# Altium schematic sheet pca10143_sheet4_misc.SchDoc: PCA10143 - Miscellaneous
size A3; Organization: Nordic Semiconductor; DocumentNumber: 4; Revision: 0.7.2; SheetNumber: 4; SheetTotal: 7; CompanyName: Nordic Semiconductor
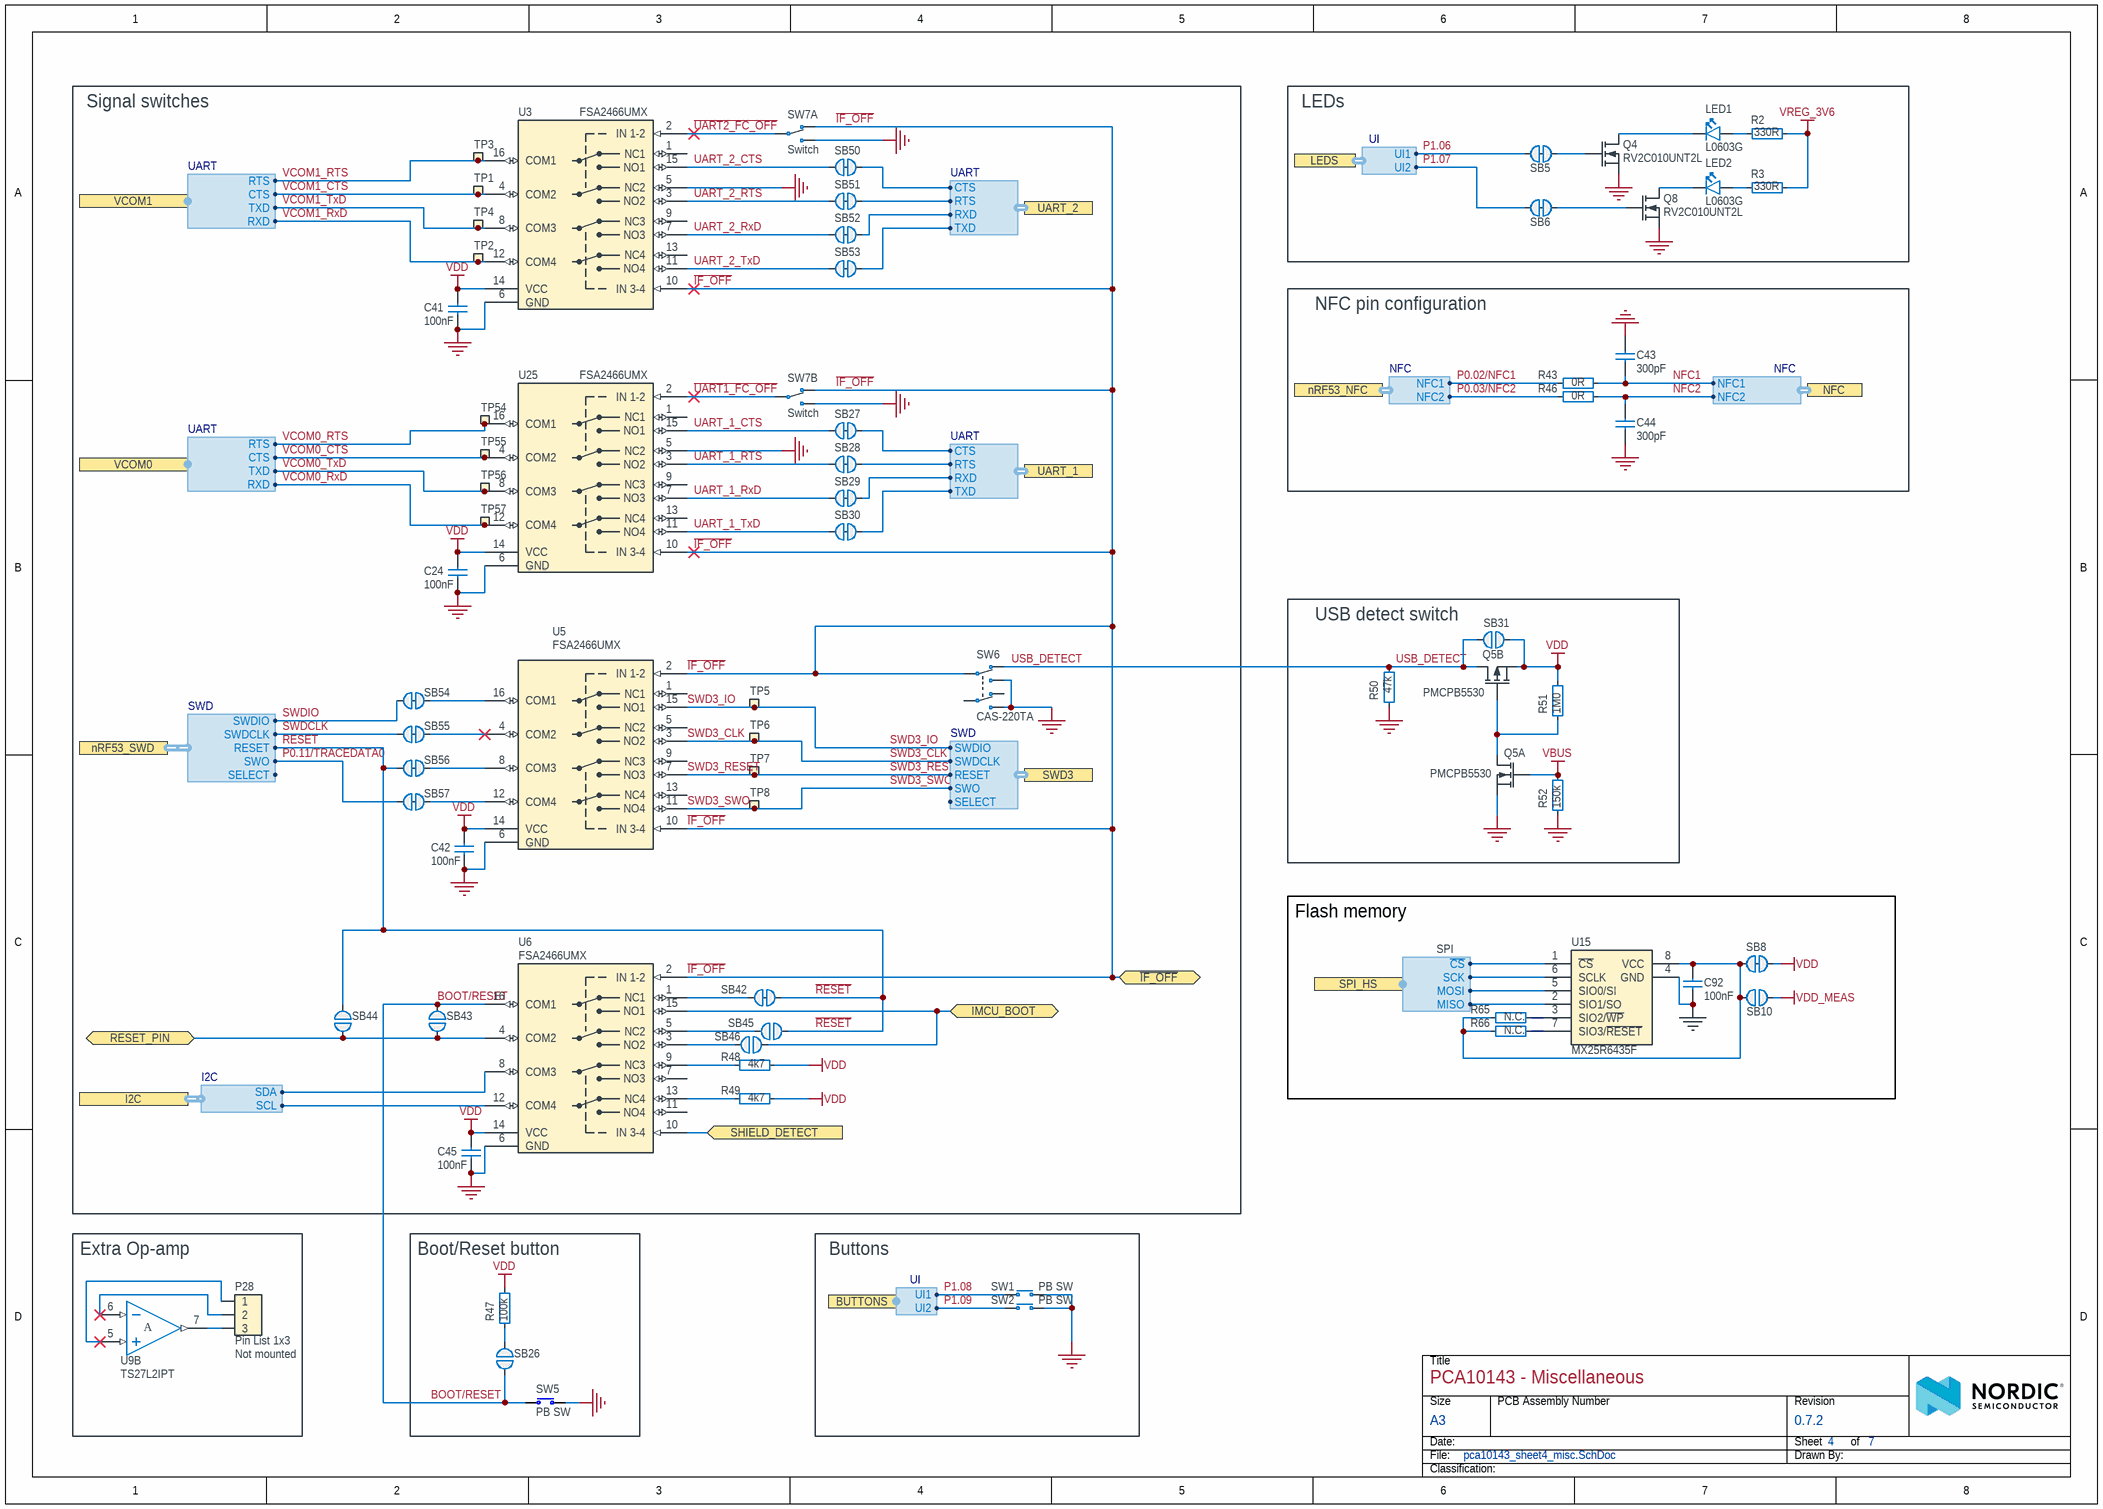
[diagram p0: pca10143_sheet4_misc.SchDoc]

## Parts
C24  100nF  [CAPC0603X03L_C]
C41  100nF  [CAPC0603X03L_C]
C42  100nF  [CAPC0603X03L_C]
C43  300pF  [CAPC1005X04L]
C44  300pF  [CAPC1005X04L]
C45  100nF  [CAPC0603X03L_C]
C92  100nF  [CAPC0603X03L_C]
LED1  L0603G  [LED_0603_G]
LED2  L0603G  [LED_0603_G]
P28  Pin List 1x3  Assembly: Not mounted  [LIST_1x3-NC]
Q4  RV2C010UNT2L  [DFN65P100X40-3L]
Q5  PMCPB5530  [PMCPB5530X]  (parts A,B of 2)
Q8  RV2C010UNT2L  [DFN65P100X40-3L]
R2  330R  [RESC0603X03L_C]
R3  330R  [RESC0603X03L_C]
R43  0R  [RESC0603X03L_C]
R46  0R  [RESC0603X03L_C]
R47  100k  [RESC0603X03L_C]
R48  4k7  [RESC0603X03L_C]
R49  4k7  [RESC0603X03L_C]
R50  47k  [RESC0603X03L_C]
R51  1M0  [RESC0603X03L_C]
R52  150k  [RESC0603X03L_C]
R65  N.C.  [RESC0603X03L_C_NC]
R66  N.C.  [RESC0603X03L_C_NC]
SB5  Solderbridge  [Solderbridge_Shorted]  (value not drawn)  (net tie, no BOM)
SB6  Solderbridge  [Solderbridge_Shorted]  (value not drawn)  (net tie, no BOM)
SB8  Solderbridge  [Solderbridge_Shorted]  (value not drawn)  (net tie, no BOM)
SB10  Solderbridge  [Solderbridge]  (value not drawn)  (no BOM)
SB26  Solderbridge  [Solderbridge]  (value not drawn)  (no BOM)
SB27  Solderbridge  [Solderbridge_Shorted]  (value not drawn)  (net tie, no BOM)
SB28  Solderbridge  [Solderbridge_Shorted]  (value not drawn)  (net tie, no BOM)
SB29  Solderbridge  [Solderbridge_Shorted]  (value not drawn)  (net tie, no BOM)
SB30  Solderbridge  [Solderbridge_Shorted]  (value not drawn)  (net tie, no BOM)
SB31  Solderbridge  [Solderbridge]  (value not drawn)  (no BOM)
SB42  Solderbridge  [Solderbridge_Shorted]  (value not drawn)  (net tie, no BOM)
SB43  Solderbridge  [Solderbridge]  (value not drawn)  (no BOM)
SB44  Solderbridge  [Solderbridge]  (value not drawn)  (no BOM)
SB45  Solderbridge  [Solderbridge]  (value not drawn)  (no BOM)
SB46  Solderbridge  [Solderbridge]  (value not drawn)  (no BOM)
SB50  Solderbridge  [Solderbridge_Shorted]  (value not drawn)  (net tie, no BOM)
SB51  Solderbridge  [Solderbridge_Shorted]  (value not drawn)  (net tie, no BOM)
SB52  Solderbridge  [Solderbridge_Shorted]  (value not drawn)  (net tie, no BOM)
SB53  Solderbridge  [Solderbridge_Shorted]  (value not drawn)  (net tie, no BOM)
SB54  Solderbridge  [Solderbridge_Shorted]  (value not drawn)  (net tie, no BOM)
SB55  Solderbridge  [Solderbridge_Shorted]  (value not drawn)  (net tie, no BOM)
SB56  Solderbridge  [Solderbridge_Shorted]  (value not drawn)  (net tie, no BOM)
SB57  Solderbridge  [Solderbridge_Shorted]  (value not drawn)  (net tie, no BOM)
SW1  PB SW  [Switch-PB-6.2x6.3mm-SMD]
SW2  PB SW  [Switch-PB-6.2x6.3mm-SMD]
SW5  PB SW  [Switch-PB-6.2x6.3mm-SMD]
SW6  CAS-220TA  [CAS-220TA]
SW7  Switch  [CAS-D20A]  (parts A,B of 2)
TP1  Ø1.5mm,SMD  [TP_SMD_D1.5mm]  (value not drawn)  (no BOM)
TP2  Ø1.5mm,SMD  [TP_SMD_D1.5mm]  (value not drawn)  (no BOM)
TP3  Ø1.5mm,SMD  [TP_SMD_D1.5mm]  (value not drawn)  (no BOM)
TP4  Ø1.5mm,SMD  [TP_SMD_D1.5mm]  (value not drawn)  (no BOM)
TP5  Ø1.5mm,SMD  [TP_SMD_D1.5mm]  (value not drawn)  (no BOM)
TP6  Ø1.5mm,SMD  [TP_SMD_D1.5mm]  (value not drawn)  (no BOM)
TP7  Ø1.5mm,SMD  [TP_SMD_D1.5mm]  (value not drawn)  (no BOM)
TP8  Ø1.5mm,SMD  [TP_SMD_D1.5mm]  (value not drawn)  (no BOM)
TP54  Ø1.5mm,SMD  [TP_SMD_D1.5mm]  (value not drawn)  (no BOM)
TP55  Ø1.5mm,SMD  [TP_SMD_D1.5mm]  (value not drawn)  (no BOM)
TP56  Ø1.5mm,SMD  [TP_SMD_D1.5mm]  (value not drawn)  (no BOM)
TP57  Ø1.5mm,SMD  [TP_SMD_D1.5mm]  (value not drawn)  (no BOM)
U3  FSA2466UMX  [XQFN40P180X260X50-16N]
U5  FSA2466UMX  [XQFN40P180X260X50-16N]
U6  FSA2466UMX  [XQFN40P180X260X50-16N]
U9  TS27L2IPT  [TSOP65P640X120-8N]  (part B of 2)
U15  MX25R6435F  [SON127P600X80_HS-9N]
U25  FSA2466UMX  [XQFN40P180X260X50-16N]

## Blocks framed on the sheet
Signal switches: C24 C41 C42 C45 R48 R49 SB27-SB30 SB42-SB46 SB50-SB57 SW6 SW7 TP1-TP8 TP54-TP57 U3 U5 U6 U25
LEDs: LED1 LED2 Q4 Q8 R2 R3 SB5 SB6
NFC pin configuration: C43 C44 R43 R46
USB detect switch: Q5 R50-R52 SB31
Flash memory: C92 R65 R66 SB8 SB10 U15
Extra Op-amp: P28 U9
Boot/Reset button: R47 SB26 SW5
Buttons: SW1 SW2

## Ports
BUTTONS (harness UI), I2C (harness I2C), IMCU_BOOT (bidir), LEDS (harness UI), NFC (harness NFC), nRF53_NFC (harness NFC), nRF53_SWD (harness SWD), RESET_PIN (bidir), SHIELD_DETECT (in), SPI_HS (harness SPI), SWD3 (harness SWD), UART_1 (harness UART), UART_2 (harness UART), VCOM0 (harness UART), VCOM1 (harness UART), ~{IF_OFF} (bidir)

## Harnesses
SWD: SWDIO, SWDCLK, SWO, RESET, SELECT
NFC: NFC2, NFC1
UI: UI2, UI1
UART: RTS, CTS, RXD, TXD
I2C: SCL, SDA
SPI: ~{CS}, SCK, MISO, MOSI

## Nets
GND: C24.1 C41.1 C42.1 C43.2 C44.1 C45.1 C92.1 Q4.2(S) Q5.1(S1) Q8.2(S) R50.2 R52.2 SW1.1(N.O) SW2.1(N.O) SW5.1(N.O) SW6.1(N.O-1) SW6.4(N.O-2) SW7.1(N.O) SW7.4(N.O) U3.5(NC2) U3.6(GND) U5.6(GND) U6.6(GND) U15.4(GND) U15.9(GND) U25.5(NC2) U25.6(GND)
VBUS: Q5.2(G1) R52.1
VDD: C24.2 C41.2 C42.2 C45.2 Q5.4(S2) R47.2 R48.1 R49.1 R51.1 SB8.1 SB31.1 U3.14(VCC) U5.14(VCC) U6.14(VCC) U25.14(VCC)
VDD_MEAS: SB10.1
VREG_3V6: R2.2 R3.2
BOOT/RESET: SB26.1 SB43.1 SW5.2(COM) U6.16(COM1)
~{IF_OFF}: SW6.2(COM-1) SW7.3(N.C) SW7.6(N.C) U3.10(IN_3-4) U5.2(IN_1-2) U5.10(IN_3-4) U6.2(IN_1-2) U25.10(IN_3-4) ; port ~{IF_OFF}
IMCU_BOOT: SB46.2 U6.15(NO1) ; port IMCU_BOOT
NFC1: C43.1 R43.1 ; port NFC.NFC1
NFC2: C44.2 R46.1 ; port NFC.NFC2
P0.02/NFC1: R43.2 ; port nRF53_NFC.NFC1
P0.03/NFC2: R46.2 ; port nRF53_NFC.NFC2
P0.11/TRACEDATA0: SB57.1 ; port nRF53_SWD.SWO
P1.06: SB5.1 ; port LEDS.UI1
P1.07: SB6.1 ; port LEDS.UI2
P1.08: SW1.2(COM) ; port BUTTONS.UI1
P1.09: SW2.2(COM) ; port BUTTONS.UI2
~{RESET}: SB42.2 SB44.2 SB45.2 SB56.1 ; port nRF53_SWD.RESET
RESET_PIN: SB43.2 SB44.1 U6.4(COM2) ; port RESET_PIN
SHIELD_DETECT: U6.10(IN_3-4) ; port SHIELD_DETECT
SWD3_CLK: TP6.1 U5.3(NO2) ; port SWD3.SWDCLK
SWD3_IO: TP5.1 U5.15(NO1) ; port SWD3.SWDIO
SWD3_RESET: TP7.1 U5.7(NO3) ; port SWD3.RESET
SWD3_SWO: TP8.1 U5.11(NO4) ; port SWD3.SWO
SWDCLK: SB55.1 ; port nRF53_SWD.SWDCLK
SWDIO: SB54.1 ; port nRF53_SWD.SWDIO
~{UART1_FC_OFF}: SW7.5(COM) U25.2(IN_1-2)
~{UART2_FC_OFF}: SW7.2(COM) U3.2(IN_1-2)
UART_1_CTS: SB27.2 U25.15(NO1)
UART_1_RTS: SB28.2 U25.3(NO2)
UART_1_RxD: SB29.2 U25.7(NO3)
UART_1_TxD: SB30.2 U25.11(NO4)
UART_2_CTS: SB50.2 U3.15(NO1)
UART_2_RTS: SB51.2 U3.3(NO2)
UART_2_RxD: SB52.2 U3.7(NO3)
UART_2_TxD: SB53.2 U3.11(NO4)
USB_DETECT: Q5.3(D2) R50.1 SB31.2 SW6.3(N.C-1)
VCOM0_CTS: TP55.1 U25.4(COM2) ; port VCOM0.CTS
VCOM0_RTS: TP54.1 U25.16(COM1) ; port VCOM0.RTS
VCOM0_RxD: TP57.1 U25.12(COM4) ; port VCOM0.RXD
VCOM0_TxD: TP56.1 U25.8(COM3) ; port VCOM0.TXD
VCOM1_CTS: TP1.1 U3.4(COM2) ; port VCOM1.CTS
VCOM1_RTS: TP3.1 U3.16(COM1) ; port VCOM1.RTS
VCOM1_RxD: TP2.1 U3.12(COM4) ; port VCOM1.RXD
VCOM1_TxD: TP4.1 U3.8(COM3) ; port VCOM1.TXD
NetC92_2: C92.2 R65.2 R66.2 SB8.2 SB10.2 U15.8(VCC)
NetLED1_1: LED1.1(C) Q4.3(D)
NetLED1_2: LED1.2(A) R2.1
NetLED2_1: LED2.1(C) Q8.3(D)
NetLED2_2: LED2.2(A) R3.1
NetP28_1: P28.1 U9.5(IN2+)
NetP28_2: P28.2 U9.6(IN2-)
NetP28_3: P28.3 U9.7(OUT2)
NetQ4_1: Q4.1(G) SB5.2
NetQ5_5: Q5.5(G2) Q5.6(D1) R51.2
NetQ8_1: Q8.1(G) SB6.2
NetR47_1: R47.1 SB26.2
NetR48_2: R48.2 U6.9(NC3)
NetR49_2: R49.2 U6.13(NC4)
NetR65_1: R65.1 U15.3(SIO2/~{WP})
NetR66_1: R66.1 U15.7(SIO3/~{RESET})
NetSB27_1: SB27.1 ; port UART_1.CTS
NetSB28_1: SB28.1 ; port UART_1.RTS
NetSB29_1: SB29.1 ; port UART_1.RXD
NetSB30_1: SB30.1 ; port UART_1.TXD
NetSB42_1: SB42.1 U6.1(NC1)
NetSB45_1: SB45.1 U6.5(NC2)
NetSB46_1: SB46.1 U6.3(NO2)
NetSB50_1: SB50.1 ; port UART_2.CTS
NetSB51_1: SB51.1 ; port UART_2.RTS
NetSB52_1: SB52.1 ; port UART_2.RXD
NetSB53_1: SB53.1 ; port UART_2.TXD
NetSB54_2: SB54.2 U5.16(COM1)
NetSB55_2: SB55.2 U5.4(COM2)
NetSB56_2: SB56.2 U5.8(COM3)
NetSB57_2: SB57.2 U5.12(COM4)
NetU6_8: U6.8(COM3) ; port I2C.SDA
NetU6_12: U6.12(COM4) ; port I2C.SCL
NetU15_1: U15.1(~{CS}) ; port SPI_HS.~{CS}
NetU15_2: U15.2(SIO1/SO) ; port SPI_HS.MISO
NetU15_5: U15.5(SIO0/SI) ; port SPI_HS.MOSI
NetU15_6: U15.6(SCLK) ; port SPI_HS.SCK

Not connected (* = marked no-connect by the designer): SW6 5(COM-2) 6(N.C-2); U3 1(NC1) 9(NC3) 13(NC4); U5 1(NC1) 5(NC2) 9(NC3) 13(NC4); U6 7(NO3) 11(NO4); U25 1(NC1) 9(NC3) 13(NC4)

## Notes on the sheet
- Title
- Size
- Date:
- File:
- A3
- PCB Assembly Number
- Sheet         of
- Drawn By:
- Revision
- Classification:
- (in symbol TS27L2IPT, part B) A

## Library data of the parts
C24 C41 C42 C45 C92 = C0201-100n: Capacitor, X5R, ±10%; Manufacturer: N.A.; Part number IPS: 00000001248, 00000002505; Part number Norautron: 262071862; Part number NEMS: 100200078; Note: 16V; Pad Count: 2; Component Status: Active; Part Number: C0201-100n; Manufacturer Part Number: N.A.; Footprint Doc: 0201; LatestRevisionDate: 2017-11-09; Published: 2014-11-13; Value: 100nF; Artikkelnr Noca: N.A.; ComponentLink1URL: N.A.; ComponentLink1Description: Datasheet; ComponentLink2URL: N.A.; ComponentLink2Description: Supplier link; HelpURL: N.A.; Supplier 1: N.A.; Supplier Part Number 1: N.A.; Supplier 2: N.A.; Supplier Part Number 2: N.A.; Component Class: Capacitors; PartId: 100200078; Author: rsk
C43 C44 = C0402-300p: Capacitor, C0G, ±5%, 50V; Manufacturer: N.A.; Part number IPS: 00000007788; Part number NEMS: 100200155; Artikkelnr Noca: 20020004; Pad Count: 2; Component Status: Active; Part Number: C0402-300p; Manufacturer Part Number: N.A.; Footprint Doc: 0402; LatestRevisionDate: 2020-10-13; Published: 2015-05-29; Value: 300pF; Note: 50V; ComponentLink1URL: N.A.; ComponentLink1Description: Datasheet; ComponentLink2URL: N.A.; ComponentLink2Description: Supplier link; HelpURL: N.A.; Supplier 1: Digi-Key; Supplier Part Number 1: 490-3234-1-ND; Supplier 2: N.A.; Supplier Part Number 2: N.A.; Component Class: Capacitors; PartId: 100200155; Author: rsk; Part number Norautron: N.A.
LED1 LED2 = VS 25C7M5: LED, Green, 0603, 573nm, Vf=2.0V, 24mcd, - 40 to +85°C; Manufacturer: Victory Electronics; Part number IPS: 00000001274, 00000009961; Part number Norautron: 26313411; Part number NEMS: 101400097; Note: N.A.; Artikkelnr Noca: 13019193; Pad Count: 2; Component Status: Active; Part Number: VS 25C7M5; Manufacturer Part Number: VS 25C7M5; Footprint Doc: 0603; LatestRevisionDate: 2020-10-23; Published: 2017-08-21; Value: L0603G; ComponentLink1URL: N.A.; ComponentLink1Description: Datasheet; ComponentLink2URL: N.A.; ComponentLink2Description: Supplier link; HelpURL: \\hizz\pro\app9717\Datasheet\optoelectronics\Victory Electronics\VS 25C7M5.pdf; Supplier 1: EC Partner; Supplier Part Number 1: N.A.; Supplier 2: N.A.; Supplier Part Number 2: N.A.; Component Class: Optoelectronics; PartId: 101400097; Author: rsk
P28 = Pin List 1x3, N.C.: Pin List 1x3, 2.54mm (100mil); Manufacturer: N.A.; Part number NEMS: 100500305; Pad Count: 3; Component Status: Active; Part Number: Pin List 1x3, N.C.; Manufacturer Part Number: N.A.; Footprint Doc: LIST_1x3; LatestRevisionDate: 2017-09-07; Published: 2017-09-07; Value: Pin List 1x3; Note: N.A.; Artikkelnr Noca: N.A.; Part number IPS: N.A.; ComponentLink1URL: N.A.; ComponentLink1Description: Datasheet; ComponentLink2URL: N.A.; ComponentLink2Description: Supplier link; HelpURL: N.A.; Supplier 1: N.A.; Supplier Part Number 1: N.A.; Supplier 2: N.A.; Supplier Part Number 2: N.A.; Component Class: Connectors; PartId: 100500305; Author: rsk; Part number Norautron: N.A.
Q4 Q8 = RV2C010UNT2L: N-Channel MOSFET, 20V, 1A, 470mOhm, 400mW; Manufacturer: Rohm Semiconductor; Part number IPS: 00000009976; Part number Norautron: 26320026; Part number NEMS: 101300132; Note: N.A.; Artikkelnr Noca: 35010020; Pad Count: 3; Component Status: Active; Part Number: RV2C010UNT2L; Manufacturer Part Number: RV2C010UNT2L; LatestRevisionDate: 2016-08-09; Published: 2016-08-09; Value: RV2C010UNT2L; Footprint Doc: DFN-3; ComponentLink1URL: N.A.; ComponentLink1Description: Datasheet; ComponentLink2URL: N.A.; ComponentLink2Description: Supplier link; HelpURL: http://rohmfs.rohm.com/en/products/databook/datasheet/discrete/transistor/mosfet/rv2c010unt2l-e.pdf; Supplier 1: Digi-Key; Supplier Part Number 1: RV2C010UNT2LCT-ND; Supplier 2: Mouser; Supplier Part Number 2: 755-RV2C010UNT2L; Component Class: Semiconductors; PartId: 101300132; Author: rsk
Q5 = PMCPB5530X,115: Mosfet Array N and P-Channel 20V 4A (Ta), 3.4A (Ta) 490mW Surface Mount 6-HUSON-EP (2x2); Manufacturer: Nexperia; Part number IPS: 00000001918; Part number NEMS: 101300165; Note: N.A.; Pad Count: 8; Component Status: Active; Part Number: PMCPB5530X,115; Manufacturer Part Number: PMCPB5530X,115; LatestRevisionDate: 2018-04-30; Published: 2018-04-30; Value: PMCPB5530; Artikkelnr Noca: N.A.; Footprint Doc: 6-UDFN; ComponentLink1URL: https://assets.nexperia.com/documents/data-sheet/PMCPB5530X.pdf; ComponentLink1Description: Datasheet; ComponentLink2URL: https://www.digikey.com/product-detail/en/nexperia-usa-inc/PMCPB5530X115/1727-1327-1-ND/4386339; ComponentLink2Description: Supplier link; HelpURL: https://www.nexperia.com/products/mosfets/small-signal-mosfets/PMCPB5530X.html; Supplier 1: Digi-Key; Supplier Part Number 1: 1727-1327-1-ND; Supplier 2: Mouser; Supplier Part Number 2: 771-PMCPB5530X115; Component Class: Semiconductors; PartId: 101300165; Author: rsk; Part number Norautron: N.A.
R2 R3 = R0201-330: Resistor, ±1%, 0.05W; Manufacturer: N.A.; Part number Norautron: 26108303; Part number NEMS: 100100034; Note: Chip Res 1%; Pad Count: 2; Component Status: Active; Part Number: R0201-330; Manufacturer Part Number: N.A.; LatestRevisionDate: 2014-11-13; Published: 2014-11-13; Value: 330R; Artikkelnr Noca: N.A.; Footprint Doc: 0201; Part number IPS: N.A.; ComponentLink1URL: N.A.; ComponentLink1Description: Datasheet; ComponentLink2URL: N.A.; ComponentLink2Description: Supplier link; HelpURL: N.A.; Supplier 1: N.A.; Supplier Part Number 1: N.A.; Supplier 2: N.A.; Supplier Part Number 2: N.A.; Component Class: Resistors; PartId: 100100034; Author: rsk
R43 R46 = R0201-0R: Resistor, ±5%, 0.05W; Manufacturer: N.A.; Part number IPS: 00000003245; Part number NEMS: 100100001; Note: Chip Res 5%; Pad Count: 2; Component Status: Active; Part Number: R0201-0R; Manufacturer Part Number: N.A.; Footprint Doc: 0201; LatestRevisionDate: 2017-11-09; Published: 2014-11-13; Value: 0R; Artikkelnr Noca: N.A.; ComponentLink1URL: N.A.; ComponentLink1Description: Datasheet; ComponentLink2URL: N.A.; ComponentLink2Description: Supplier link; HelpURL: N.A.; Supplier 1: N.A.; Supplier Part Number 1: N.A.; Supplier 2: N.A.; Supplier Part Number 2: N.A.; Component Class: Resistors; PartId: 100100001; Author: rsk; Part number Norautron: N.A.
R47 = R0201-100k: Resistor, ±1%, 0.05W; Manufacturer: N.A.; Part number IPS: 00000001419; Part number Norautron: 26108487; Part number NEMS: 100100080; Note: Chip Res 1%; Pad Count: 2; Component Status: Active; Part Number: R0201-100k; Manufacturer Part Number: N.A.; Footprint Doc: 0201; LatestRevisionDate: 2014-11-13; Published: 2014-11-13; Value: 100k; Artikkelnr Noca: N.A.; ComponentLink1URL: N.A.; ComponentLink1Description: Datasheet; ComponentLink2URL: N.A.; ComponentLink2Description: Supplier link; HelpURL: N.A.; Supplier 1: N.A.; Supplier Part Number 1: N.A.; Supplier 2: N.A.; Supplier Part Number 2: N.A.; Component Class: Resistors; PartId: 100100080; Author: rsk
R48 R49 = R0201-4k7: Resistor, ±1%, 0.05W; Manufacturer: N.A.; Part number IPS: 00000001706; Part number NEMS: 100100061; Note: Chip Res 1%; Pad Count: 2; Component Status: Active; Part Number: R0201-4k7; Manufacturer Part Number: N.A.; Footprint Doc: 0201; LatestRevisionDate: 2014-11-13; Published: 2014-11-13; Value: 4k7; Artikkelnr Noca: N.A.; ComponentLink1URL: N.A.; ComponentLink1Description: Datasheet; ComponentLink2URL: N.A.; ComponentLink2Description: Supplier link; HelpURL: N.A.; Supplier 1: N.A.; Supplier Part Number 1: N.A.; Supplier 2: N.A.; Supplier Part Number 2: N.A.; Component Class: Resistors; PartId: 100100061; Author: rsk; Part number Norautron: N.A.
R50 = R0201-47k: Resistor, ±1%, 0.05W; Manufacturer: N.A.; Part number IPS: 00000001423; Part number NEMS: 100100076; Note: Chip Res 1%; Pad Count: 2; Component Status: Active; Part Number: R0201-47k; Manufacturer Part Number: N.A.; LatestRevisionDate: 2014-11-13; Published: 2014-11-13; Value: 47k; Artikkelnr Noca: N.A.; Footprint Doc: 0201; ComponentLink1URL: N.A.; ComponentLink1Description: Datasheet; ComponentLink2URL: N.A.; ComponentLink2Description: Supplier link; HelpURL: N.A.; Supplier 1: N.A.; Supplier Part Number 1: N.A.; Supplier 2: N.A.; Supplier Part Number 2: N.A.; Component Class: Resistors; PartId: 100100076; Author: rsk; Part number Norautron: N.A.
R51 = R0201-1M0: Resistor, ±1%, 0.05W; Manufacturer: N.A.; Part number IPS: 00000001418; Part number Norautron: 26107108; Part number NEMS: 100100093; Note: Chip Res 1%; Pad Count: 2; Component Status: Active; Part Number: R0201-1M0; Manufacturer Part Number: N.A.; LatestRevisionDate: 2014-11-13; Published: 2014-11-13; Value: 1M0; Artikkelnr Noca: N.A.; Footprint Doc: 0201; ComponentLink1URL: N.A.; ComponentLink1Description: Datasheet; ComponentLink2URL: N.A.; ComponentLink2Description: Supplier link; HelpURL: N.A.; Supplier 1: N.A.; Supplier Part Number 1: N.A.; Supplier 2: N.A.; Supplier Part Number 2: N.A.; Component Class: Resistors; PartId: 100100093; Author: rsk
R52 = R0201-150k: Resistor, ±1%, 0.05W; Manufacturer: N.A.; Part number IPS: 00000001422; Part number NEMS: 100100082; Note: Chip Res 1%; Pad Count: 2; Component Status: Active; Part Number: R0201-150k; Manufacturer Part Number: N.A.; LatestRevisionDate: 2014-11-13; Published: 2014-11-13; Value: 150k; Artikkelnr Noca: N.A.; Footprint Doc: 0201; ComponentLink1URL: N.A.; ComponentLink1Description: Datasheet; ComponentLink2URL: N.A.; ComponentLink2Description: Supplier link; HelpURL: N.A.; Supplier 1: N.A.; Supplier Part Number 1: N.A.; Supplier 2: N.A.; Supplier Part Number 2: N.A.; Component Class: Resistors; PartId: 100100082; Author: rsk; Part number Norautron: N.A.
R65 R66 = R0201-N.C.: Not mounted; Manufacturer: N.A.; Part number NEMS: 100100107; Assembly: Not mounted; Note: Chip Res; Pad Count: 2; Component Status: Active; Part Number: R0201-N.C.; Manufacturer Part Number: N.A.; Footprint Doc: 0201; LatestRevisionDate: 2014-11-13; Published: 2014-11-13; Value: N.C.; Artikkelnr Noca: N.A.; Part number IPS: N.A.; ComponentLink1URL: N.A.; ComponentLink1Description: Datasheet; ComponentLink2URL: N.A.; ComponentLink2Description: Supplier link; HelpURL: N.A.; Supplier 1: N.A.; Supplier Part Number 1: N.A.; Supplier 2: N.A.; Supplier Part Number 2: N.A.; Component Class: Resistors; PartId: 100100107; Author: rsk; Part number Norautron: N.A.
SB5 SB6 SB8 SB27-SB30 SB42 SB50-SB57 = Solderbridge Shorted: Shorted Solderbridge; Manufacturer: N.A.; Part number NEMS: 100500459; Pad Count: 2; Component Status: Active; Part Number: Solderbridge Shorted; Manufacturer Part Number: N.A.; LatestRevisionDate: 2012-08-07; Published: 2012-08-07; Value: Solderbridge; Note: N.A.; Artikkelnr Noca: N.A.; Footprint Doc: Solderbridge_Shorted; Part number IPS: N.A.; ComponentLink1URL: N.A.; ComponentLink1Description: Datasheet; ComponentLink2URL: N.A.; ComponentLink2Description: Supplier link; HelpURL: N.A.; Supplier 1: N.A.; Supplier Part Number 1: N.A.; Supplier 2: N.A.; Supplier Part Number 2: N.A.; Component Class: Connectors; PartId: 100500459; Author: rsk; Part number Norautron: N.A.
SB10 SB26 SB31 SB43-SB46 = Solderbridge: Manufacturer: N.A.; Part number NEMS: 100500458; Pad Count: 2; Component Status: Active; Part Number: Solderbridge; Manufacturer Part Number: N.A.; LatestRevisionDate: 2009-12-14; Published: 2009-12-14; Value: Solderbridge; Note: N.A.; Artikkelnr Noca: N.A.; Footprint Doc: Solderbridge; Part number IPS: N.A.; ComponentLink1URL: N.A.; ComponentLink1Description: Datasheet; ComponentLink2URL: N.A.; ComponentLink2Description: Supplier link; HelpURL: N.A.; Supplier 1: N.A.; Supplier Part Number 1: N.A.; Supplier 2: N.A.; Supplier Part Number 2: N.A.; Component Class: Connectors; PartId: 100500458; Author: rsk; Part number Norautron: N.A.
SW1 SW2 SW5 = Switch-PB-6.2x6.3mm-SMD: Tactile Switch, SPNO, SMD, 160gf, 6.2x6.3x2.5mm; Manufacturer: Dailywell; Manufacturer Part Number: TS604VM1-025BR-R; Part number IPS: 00000007812; Part number NEMS: 101500001; Note: N.A.; Artikkelnr Noca: 50019106; Pad Count: 4; Component Status: Active; Part Number: Switch-PB-6.2x6.3mm-SMD; Footprint Doc: Switch-PB-6.2x6.3mm-SMD; LatestRevisionDate: 2016-04-21; Published: 2010-02-01; Value: PB SW; ComponentLink1URL: N.A.; ComponentLink1Description: Datasheet; ComponentLink2URL: N.A.; ComponentLink2Description: Supplier link; HelpURL: \\hizz\pro\app9717\Datasheet\switches\Dailywell\TS604VM1-025BR-R.pdf; Supplier 1: Cabcon; Supplier Part Number 1: TS604VM1-025BR-R; Supplier 2: Mouser; Supplier Part Number 2: 688-SKHUALE010; Component Class: Switches; PartId: 101500001; Author: rsk; Part number Norautron: N.A.
SW6 = CAS-220TA: Slide Switch DPDT J Hook; Manufacturer: Copal Electronics Inc; Part number IPS: 00000009983; Part number NEMS: 101500003; Note: N.A.; Artikkelnr Noca: 50019042; Pad Count: 6; Component Status: Active; Part Number: CAS-220TA; Manufacturer Part Number: CAS-220TA; Footprint Doc: CAS-220TA; LatestRevisionDate: 2010-02-18; Published: 2010-02-18; Value: CAS-220TA; ComponentLink1URL: N.A.; ComponentLink1Description: Datasheet; ComponentLink2URL: N.A.; ComponentLink2Description: Supplier link; HelpURL: http://media.digikey.com/pdf/Data%20Sheets/COPAL%20Electronics%20PDFs/CAS%20SMD%20Slide%20Switch.pdf; Supplier 1: Digi-Key; Supplier Part Number 1: CAS220JTR-ND; Supplier 2: N.A.; Supplier Part Number 2: N.A.; Component Class: Switches; PartId: 101500003; Author: rsk; Part number Norautron: N.A.
SW7 = CAS-D20TA: SMD slide Switch 2xSPDT; Manufacturer: Copal Electronics Inc; Part number NEMS: 101500004; Pad Count: 6; Note: N.A.; Component Status: Active; Part Number: CAS-D20TA; PartId: 101500004; Component Class: Switches; Author: rsk; Manufacturer Part Number: CAS-D20TA; ComponentLink1URL: N.A.; ComponentLink1Description: Datasheet; ComponentLink2URL: N.A.; ComponentLink2Description: Supplier link; HelpURL: http://copal-electronics.info/jp/0019b/cas_ja.pdf; Footprint Doc: CAS-D20A; LatestRevisionDate: 2012-10-08; Published: 2012-10-08; Value: Switch; Supplier 1: Digi-Key; Supplier Part Number 1: CASD20JTR-ND; Supplier 2: N.A.; Supplier Part Number 2: N.A.; Artikkelnr Noca: N.A.; Part number IPS: N.A.; Part number Norautron: N.A.
TP1-TP8 TP54-TP57 = TP_SMD_Ø1.5MM: 1.5mm circular SMD testpad; Manufacturer: Nordic Semiconductor; Manufacturer Part Number: N.A.; Part number NEMS: 100500477; Pad Count: 1; Component Status: Active; Part Number: TP_SMD_Ø1.5MM; LatestRevisionDate: 2021-03-05; Published: 2016-06-02; Value: Ø1.5mm,SMD; Note: N.A.; Artikkelnr Noca: N.A.; Footprint Doc: TP_SMD_Ø1.5mm; Part number IPS: N.A.; ComponentLink1URL: N.A.; ComponentLink1Description: Datasheet; ComponentLink2URL: N.A.; ComponentLink2Description: Supplier link; HelpURL: N.A.; Supplier 1: N.A.; Supplier Part Number 1: N.A.; Supplier 2: N.A.; Supplier Part Number 2: N.A.; Component Class: Connectors; PartId: 100500477; Author: rsk; Part number Norautron: N.A.
U3 U5 U6 U25 = FSA2466UMX: Data / Audio Low-Voltage Dual DPDT Analog Switch; Manufacturer: ON Semiconductor; Part number IPS: 00000009986; Part number Norautron: 26500608; Part number NEMS: 101900422; Note: N.A.; Artikkelnr Noca: 15070069; Pad Count: 16; Component Status: Active; Part Number: FSA2466UMX; Manufacturer Part Number: FSA2466UMX; Footprint Doc: UFQFN-16; LatestRevisionDate: 2019-05-15; Published: 2016-05-18; Value: FSA2466UMX; ComponentLink1URL: N.A.; ComponentLink1Description: Datasheet; ComponentLink2URL: N.A.; ComponentLink2Description: Supplier link; HelpURL: https://www.onsemi.com/pub/Collateral/FSA2466-D.PDF; Supplier 1: Digi-Key; Supplier Part Number 1: FSA2466UMXCT-ND; Supplier 2: Mouser; Supplier Part Number 2: 512-FSA2466UMX; Component Class: Misc_ICs; PartId: 101900422; Author: rsk
U9 = TS27L2IPT: Precision very low power CMOS dual operational amplifier; Manufacturer: STMicroelectronics; Part number IPS: 00000009991; Part number NEMS: 101900442; Note: N.A.; Artikkelnr Noca: 17010019; Pad Count: 8; Component Status: Active; Part Number: TS27L2IPT; Manufacturer Part Number: TS27L2IPT; Footprint Doc: TSSOP-8; LatestRevisionDate: 2016-07-07; Published: 2016-07-07; Value: TS27L2IPT; ComponentLink1URL: N.A.; ComponentLink1Description: Datasheet; ComponentLink2URL: N.A.; ComponentLink2Description: Supplier link; HelpURL: http://www.st.com/content/ccc/resource/technical/document/datasheet/38/5b/ca/bd/c0/26/4a/34/CD00000880.pdf/files/CD00000880.pdf/jcr:content/translations/en.CD00000880.pdf; Supplier 1: Digi-Key; Supplier Part Number 1: 497-8085-1-ND; Supplier 2: N.A.; Supplier Part Number 2: N.A.; Component Class: Misc_ICs; PartId: 101900442; Author: rsk; Part number Norautron: N.A.
U15 = MX25R6435FZNIL0: Ultra low power, 64M-bit, serial multi I/O flash memory; Manufacturer: Macronix; Part number IPS: 00000004370; Part number NEMS: 101900438; Note: N.A.; Artikkelnr Noca: 15020015; Pad Count: 8; Component Status: Active; Part Number: MX25R6435FZNIL0; Manufacturer Part Number: MX25R6435FZNIL0; Footprint Doc: WSON-8; LatestRevisionDate: 2021-02-26; Published: 2016-06-29; Value: MX25R6435F; ComponentLink1URL: N.A.; ComponentLink1Description: Datasheet; ComponentLink2URL: N.A.; ComponentLink2Description: Supplier link; HelpURL: https://www.macronix.com/Lists/Datasheet/Attachments/7913/MX25R6435F,%20Wide%20Range,%2064Mb,%20v1.5.pdf; Supplier 1: Future; Supplier Part Number 1: MX25R6435FZNIL0; Supplier 2: Arrow; Supplier Part Number 2: MX25R6435FZNIL0; Component Class: Misc_ICs; PartId: 101900438; Author: rsk; Part number Norautron: N.A.